# EAGLE design BSF (EAGLE 9.6.2)
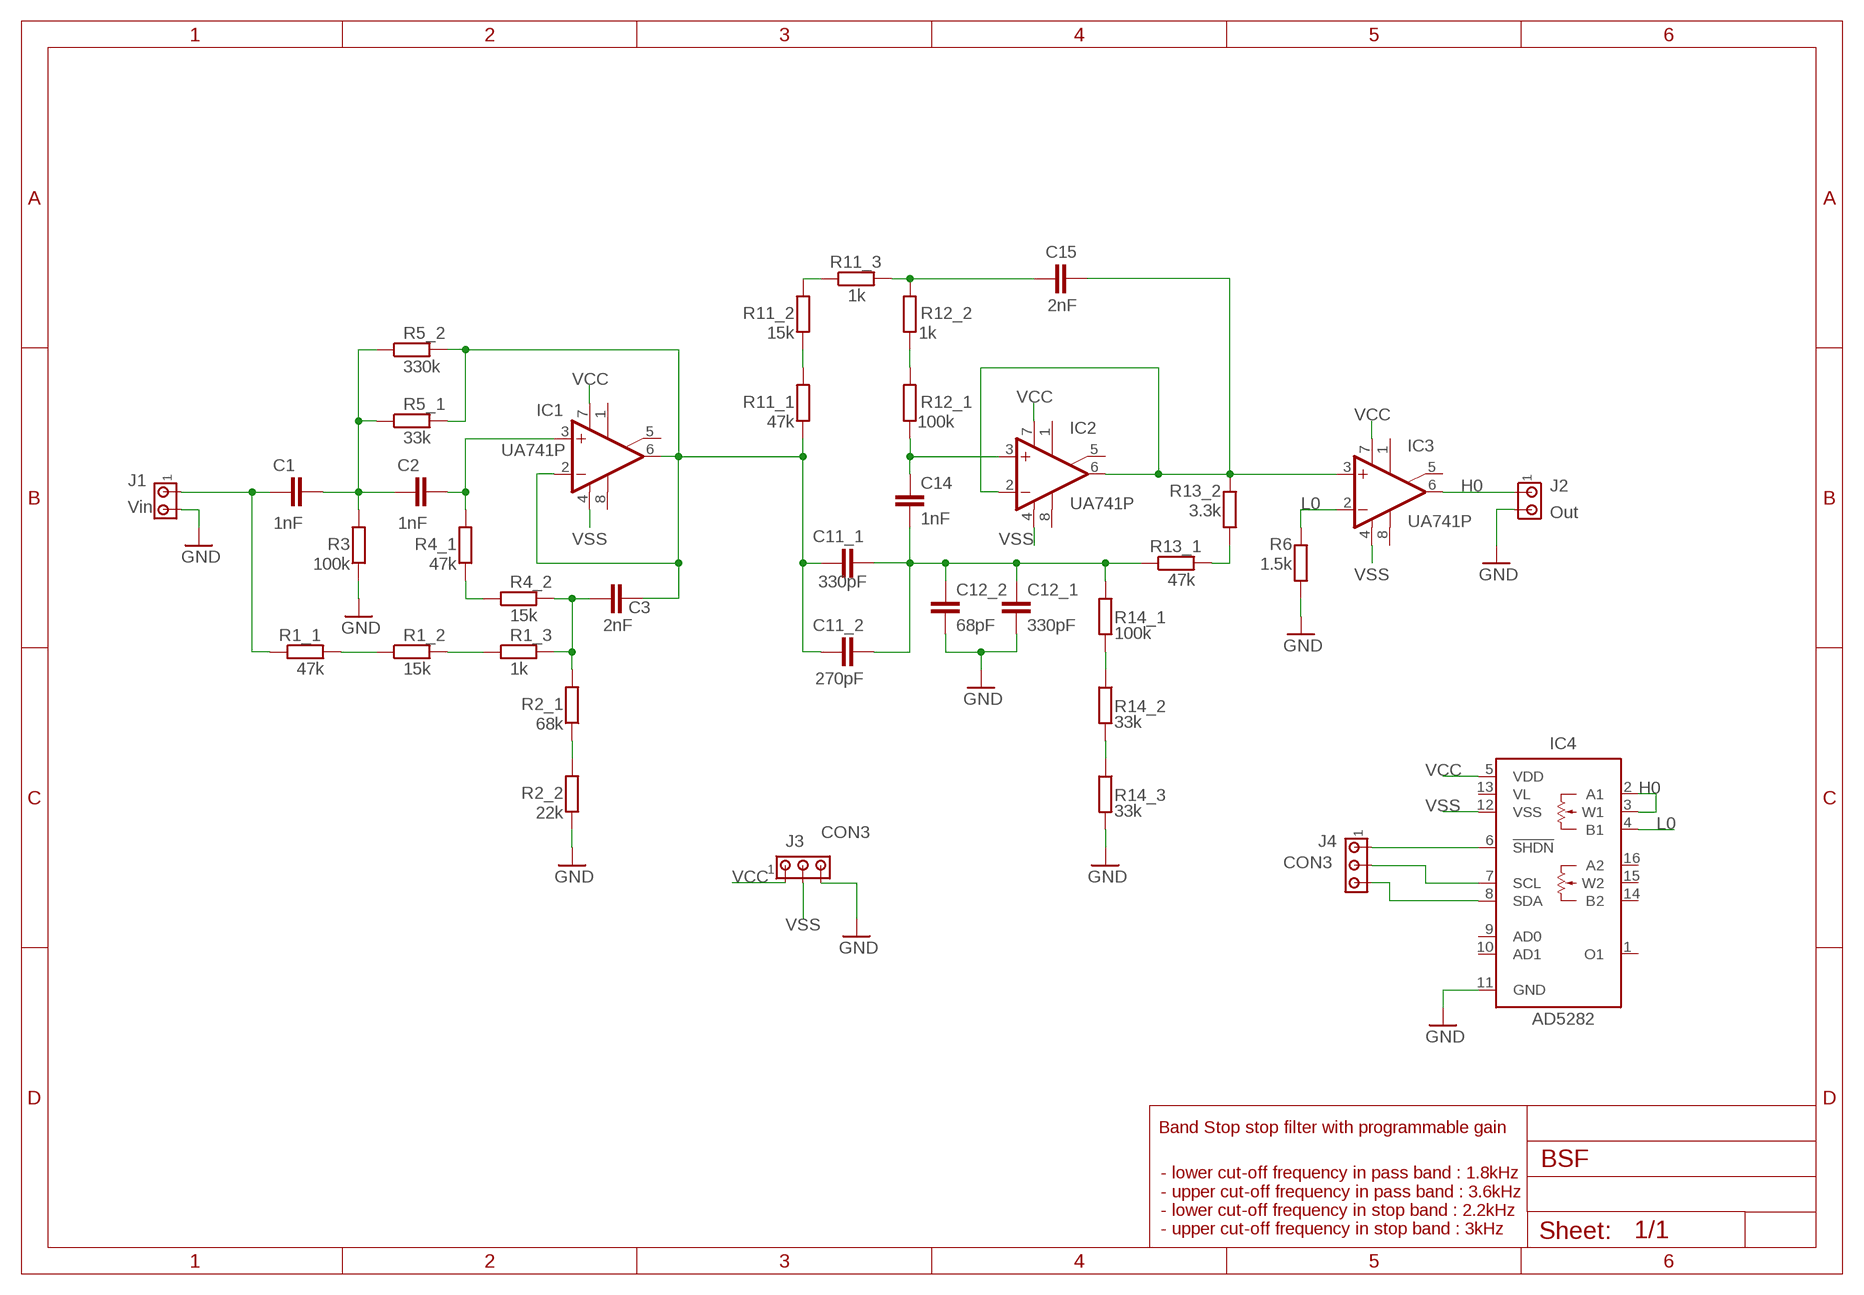
[diagram p0: schematic, sheet 1]

## Parts
C1  1nF  C-EUC0805  [C0805]
C2  1nF  C-EUC0805  [C0805]
C3  2nF  C-EUC0805  [C0805]
C11_1  330pF  C-EUC0805  [C0805]
C11_2  270pF  C-EUC0805  [C0805]
C12_1  330pF  C-EUC0805  [C0805]
C12_2  68pF  C-EUC0805  [C0805]
C14  1nF  C-EUC0805  [C0805]
C15  2nF  C-EUC0805  [C0805]
IC1  UA741P  [DIL08]
IC2  UA741P  [DIL08]
IC3  UA741P  [DIL08]
IC4  AD5282  [TSSOP16]
J1  Vin  MTA02-156  [1X2MTA]
J2  Out  MTA02-156  [1X2MTA]
J3  CON3  MTA03-156  [1X3MTA]
J4  CON3  MTA03-156  [1X3MTA]
R1_1  47k  R-EU_R0805  [R0805]
R1_2  15k  R-EU_R0805  [R0805]
R1_3  1k  R-EU_R0805  [R0805]
R2_1  68k  R-EU_R0805  [R0805]
R2_2  22k  R-EU_R0805  [R0805]
R3  100k  R-EU_R0805  [R0805]
R4_1  47k  R-EU_R0805  [R0805]
R4_2  15k  R-EU_R0805  [R0805]
R5_1  33k  R-EU_R0805  [R0805]
R5_2  330k  R-EU_R0805  [R0805]
R6  1.5k  R-EU_R0805  [R0805]
R11_1  47k  R-EU_R0805  [R0805]
R11_2  15k  R-EU_R0805  [R0805]
R11_3  1k  R-EU_R0805  [R0805]
R12_1  100k  R-EU_R0805  [R0805]
R12_2  1k  R-EU_R0805  [R0805]
R13_1  47k  R-EU_R0805  [R0805]
R13_2  3.3k  R-EU_R0805  [R0805]
R14_1  100k  R-EU_R0805  [R0805]
R14_2  33k  R-EU_R0805  [R0805]
R14_3  33k  R-EU_R0805  [R0805]

## Nets
GND: C12_1.2 C12_2.2 IC4.11(GND) J1.2 J2.2 J3.3 R2_2.1 R3.1 R6.1 R14_3.2
H0: IC3.6(OUT) IC4.2(A1) IC4.3(W1) J2.1
L0: IC3.2(-IN) IC4.4(B1) R6.2
N$1: C15.1 R11_3.2 R12_2.2
N$2: C1.1 J1.1 R1_1.1
N$3: C1.2 C2.1 R3.2 R5_1.1 R5_2.1
N$4: R1_1.2 R1_2.1
N$5: R1_2.2 R1_3.1
N$6: R4_1.1 R4_2.1
N$7: C2.2 IC1.3(+IN) R4_1.2
N$8: C3.1 R1_3.2 R2_1.2 R4_2.2
N$9: R2_1.1 R2_2.2
N$10: IC4.6(!SHDN) J4.1
N$11: IC4.7(SCL) J4.2
N$12: IC4.8(SDA) J4.3
N$13: R11_2.2 R11_3.1
N$14: C3.2 C11_1.1 C11_2.1 IC1.2(-IN) IC1.6(OUT) R5_1.2 R5_2.2 R11_1.1
N$15: R11_1.2 R11_2.1
N$16: R12_1.2 R12_2.1
N$17: C14.1 IC2.3(+IN) R12_1.1
N$18: C11_1.2 C11_2.2 C12_1.1 C12_2.1 C14.2 R13_1.1 R14_1.1
N$19: R14_1.2 R14_2.1
N$20: R14_2.2 R14_3.1
N$21: C15.2 IC2.2(-IN) IC2.6(OUT) IC3.3(+IN) R13_2.2
N$22: R13_1.2 R13_2.1
VCC: IC1.7(V+) IC2.7(V+) IC3.7(V+) IC4.5(VDD) J3.1
VSS: IC1.4(V-) IC2.4(V-) IC3.4(V-) IC4.12(VSS) J3.2
Unconnected: IC1.1(ON1) IC1.5(ON2) IC1.8(OPT) IC2.1(ON1) IC2.5(ON2) IC2.8(OPT) IC3.1(ON1) IC3.5(ON2) IC3.8(OPT) IC4.1(O1) IC4.9(AD0) IC4.10(AD1) IC4.14(B2) IC4.15(W2) IC4.16(A2)

## Notes on the sheet
- Band Stop stop filter with programmable gain
- - lower cut-off frequency in pass band : 1.8kHz
  - upper cut-off frequency in pass band : 3.6kHz
  - lower cut-off frequency in stop band : 2.2kHz
  - upper cut-off frequency in stop band : 3kHz

## Power pins joined to a net without a drawn wire
VL: IC4.13(VL)

## Library data of the parts
C1-C3 C11_1 C11_2 C12_1 C12_2 C14 C15 = rcl:C-EU: CAPACITOR, European symbol; SPICEPREFIX: C
IC1-IC3 = linear:*741: OP AMP
IC4 = analog-devices:AD5282: Dual +15 V/±5 V, 256-Position, I2C-Compatible Digital Potentiometer Source: http://www.analog.com/static/imported-files/data_sheets/AD5280_5282.pdf; MF: ALTERA CORPORATION; MPN: AD5282BRUZ50; OC_FARNELL: 1438442; OC_NEWARK: 59K3850
J1 J2 = con-amp:MTA02-156: AMP connector
J3 J4 = con-amp:MTA03-156: AMP connector
R1_1-R1_3 R2_1 R2_2 R3 R4_1 R4_2 R5_1 R5_2 R6 R11_1-R11_3 R12_1 R12_2 R13_1 R13_2 R14_1-R14_3 = rcl:R-EU_: RESISTOR, European symbol; SPICEPREFIX: R

## Net classes
0 default: width 0.381 mm, drill 0.508 mm, clearance 0.254 mm

## Board
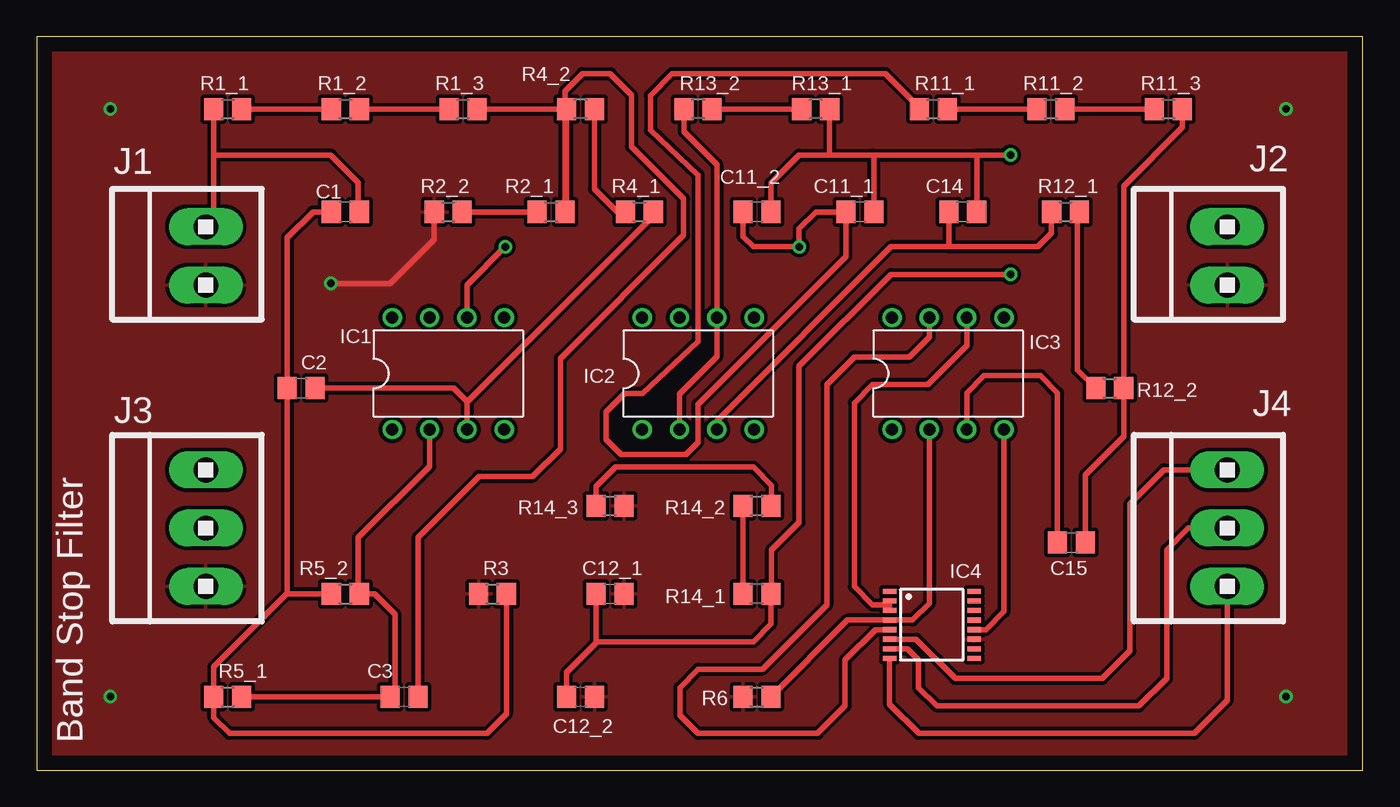
[diagram p1: board, top side]
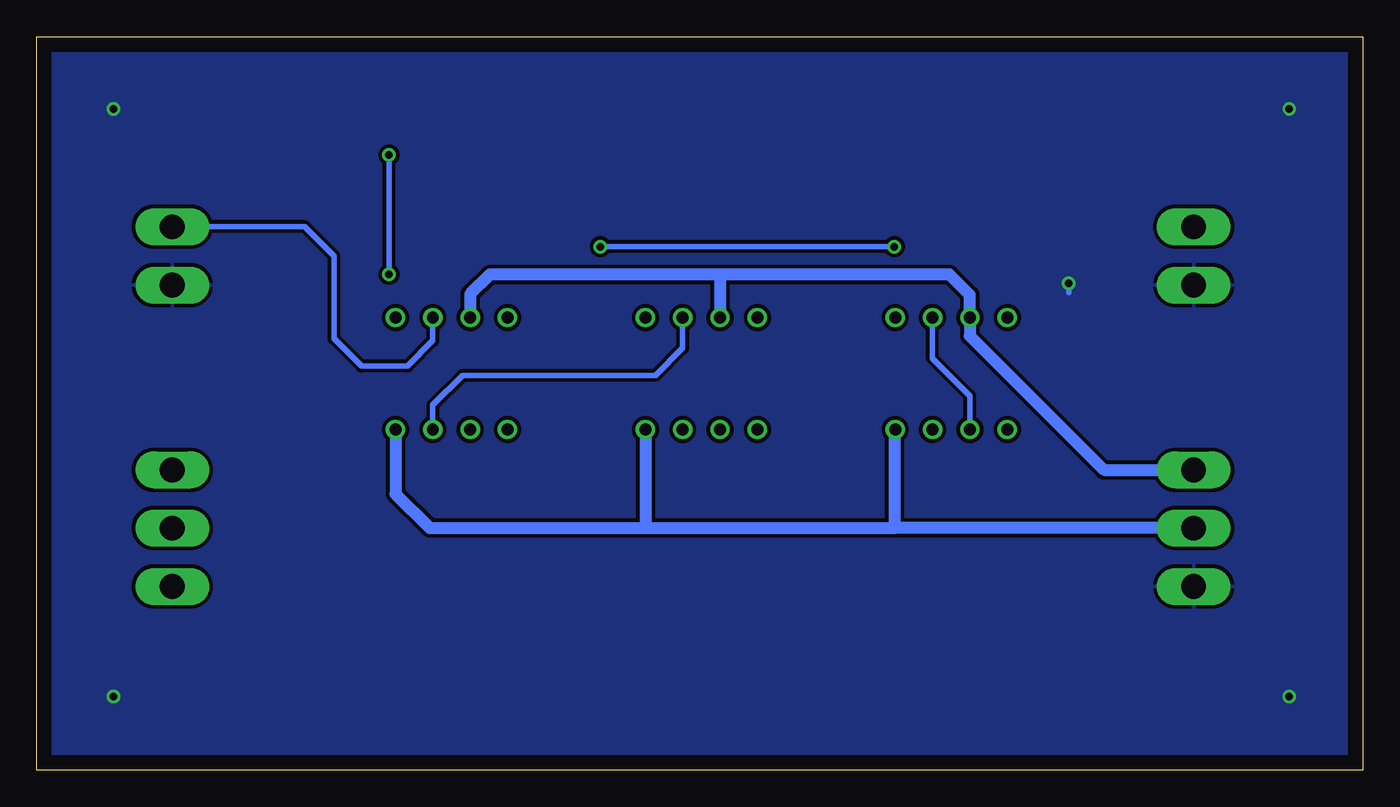
[diagram p2: board, bottom side, seen from below]

Size 90.22 x 49.92 mm. Coordinates in mm from the lower left corner, seen from the top.
Outline: 0,0 90.22,0 90.22,49.92 0,49.92 0,0
Copper layers (1*16): Top 0.035mm / dielectric 1.5mm / Bottom 0.035mm
Design rules "default": minimum track width 6mil, minimum drill 0.35mm, track to track 6mil, track to pad 6mil, pad to pad 6mil, via to via 6mil, smd to smd 6mil, copper to edge 40mil, drill to drill 6mil, minimum pad ring 10mil, minimum via ring 8mil, stop-mask expansion 4mil, vias tented up to drill 0mil, thermal gap 10mil

### Footprints (pad centres in the part's own frame; a part is rotated, then mirrored left to right if it is on the bottom)
C0805 = smd 1.3 x 1.5: 1 -0.95,0; 2 0.95,0
DIL08 = drill 0.813 pad 1.27: 1 -3.81,-3.81; 2 -1.27,-3.81; 3 1.27,-3.81; 4 3.81,-3.81; 5 3.81,3.81; 6 1.27,3.81; 7 -1.27,3.81; 8 -3.81,3.81
TSSOP16 = smd 0.9 x 0.35: 1 -2.875,2.275; 2 -2.875,1.625; 3 -2.875,0.975; 4 -2.875,0.325; 5 -2.875,-0.325; 6 -2.875,-0.975; 7 -2.875,-1.625; 8 -2.875,-2.275; 9 2.875,-2.275; 10 2.875,-1.625; 11 2.875,-0.975; 12 2.875,-0.325; 13 2.875,0.325; 14 2.875,0.975; 15 2.875,1.625; 16 2.875,2.275
1X2MTA = drill 1.676 long: 1 1.981,0; 2 -1.981,0
1X3MTA = drill 1.676 long: 1 3.937,0; 2 -0.025,0; 3 -3.988,0
R0805 = smd 1.3 x 1.5: 1 -0.95,0; 2 0.95,0

### Placement (x,y rotation side)
C1  21,38 180 top
C2  18,26 0 top
C3  25,5 180 top
C11_1  56,38 0 top
C11_2  49,38 0 top
C12_1  39,12 0 top
C12_2  37,5 0 top
C14  63,38 0 top
C15  70.41,15.5 180 top
IC1  28,27 0 top
IC2  45,27 0 top
IC3  62,27 0 top
IC4  60.9,9.89 0 top
J1  11.5,35 90 top
J2  81,35 90 top
J3  11.5,16.5 90 top
J4  81,16.5 90 top
R1_1  13,45 0 top
R1_2  21,45 0 top
R1_3  29,45 0 top
R2_1  35,38 0 top
R2_2  28,38 0 top
R3  31,12 0 top
R4_1  41,38 0 top
R4_2  37,45 180 top
R5_1  13,5 0 top
R5_2  21,12 0 top
R6  49,5 0 top
R11_1  61,45 0 top
R11_2  69,45 0 top
R11_3  77,45 0 top
R12_1  70,38 0 top
R12_2  73,26 0 top
R13_1  53,45 180 top
R13_2  45,45 180 top
R14_1  49,12 180 top
R14_2  49,18 0 top
R14_3  39,18 0 top

### Tracks (layer width: path | path; a pad name or v marks a point on that pad's centre or on a via)
GND  (via drill 0.51)
  Top 0.381: v20,33.12 24.05,33.12 27.05,36.12 R2_2.1
  Bottom 0.381: v20,33.12 20,32.5
  other vias: 5,5 85,45 85,5 5,45
  pour Top: -2.5,52.5 92.5,52.5 92.5,-2.5 -2.5,-2.5
  pour Bottom: -2.5,52.5 92.5,52.5 92.5,-2.5 -2.5,-2.5
H0
  Top 0.381: IC3.6 63.27,28.89 60.62,26.25 56.88,26.25 55.62,25 55.62,12.5 56.88,11.25 57.76,11.25 IC4.2 IC4.3
  Bottom 0.381: IC3.6 63.27,29.23 65,27.5 68.12,27.5 70,29.38 70,35 71.98,36.98 J2.1
L0
  Top 0.381: IC3.2 60.73,11.36 59.59,10.22 IC4.4 55.17,10.22 R6.2
N$1
  Top 0.381: C15.1 71.36,20.11 73.95,22.7 R12_2.2 73.95,39.75 77.95,43.75 R11_3.2
N$2
  Top 0.381: R1_1.1 12.05,41.88 | 12.05,41.88 12.05,36.98 J1.1 | C1.1 21.88,38.08 21.88,40 20,41.88 12.05,41.88
N$3
  Top 0.381: C1.2 18.8,38 17.05,36.25 C2.1 17.05,12 R5_2.1 17,12 12.05,7.05 R5_1.1 12.05,3.58 13.12,2.5 30.62,2.5 31.95,3.83 R3.2
N$4
  Top 0.381: R1_1.2 R1_2.1
N$5
  Top 0.381: R1_2.2 R1_3.1
N$6
  Top 0.381: R4_1.1 39.5,38 37.95,39.55 R4_2.1
N$7
  Top 0.381: C2.2 28.38,26 29.27,25.11 29.27,25.07 | R4_1.2 41.95,37.74 29.27,25.07 | 29.27,25.07 IC1.3
N$8
  Top 0.381: R1_3.2 R4_2.2 36.05,38.1 R2_1.2 35.95,46.23 37.13,47.41 39.01,47.41 40.46,45.96 40.46,42.45 44.01,38.9 44.01,36.42 35.62,28.04 35.62,21.88 33.75,20 30.09,20 25.95,15.86 C3.1
N$9
  Top 0.381: R2_1.1 R2_2.2
N$10
  Top 0.381: IC4.6 59.83,8.92 62.5,6.25 72.5,6.25 74.38,8.12 74.38,18.12 76.69,20.44 J4.1
N$11
  Top 0.381: IC4.7 59.23,8.27 60,7.5 60,5.62 61.25,4.38 75,4.38 76.88,6.25 76.88,15 78.35,16.48 J4.2
N$12
  Top 0.381: J4.3 81,4.75 78.75,2.5 60.02,2.5 58.02,4.5 IC4.8
N$13
  Top 0.381: R11_2.2 R11_3.1
N$14  (via drill 0.51)
  Top 0.381: R5_1.2 C3.2 24.38,5 24.38,10.62 23,12 R5_2.2 21.88,12.07 21.88,15.84 26.73,20.69 IC1.2 | C11_2.1 48.05,36.33 48.75,35.62 v51.88,35.62 51.88,36.88 53,38 C11_1.1 55.05,34.96 44.98,24.9 44.98,22.31 44.17,21.5 39.75,21.5 38.75,22.5 38.75,24.38 40,25.62 41.21,25.62 45,29.17 45,40.5 41.74,43.55 41.74,45.92 43.23,47.41 57.74,47.41 60.05,45.1 R11_1.1 | IC1.6 29.27,33.02 v31.88,35.62
  Bottom 0.381: IC1.2 26.73,25.48 29.27,28.02 IC1.6 | v31.88,35.62 v51.88,35.62
N$15
  Top 0.381: R11_1.2 R11_2.1
N$16
  Top 0.381: R12_1.2 70.8,37.85 70.8,27.25 R12_2.1
N$17
  Top 0.381: C14.1 62.05,35.62 | 62.05,35.62 68.12,35.62 69.05,36.55 R12_1.1 | 62.05,35.62 58.12,35.62 46.27,23.77 IC2.3
N$18  (via drill 0.51)
  Top 0.381: 63.95,41.88 C14.2 | C12_2.1 36.05,6.67 38.05,8.68 38.05,8.75 | C12_1.1 38.05,8.75 | 38.05,8.75 48.75,8.75 49.95,9.95 R14_1.1 50,12.05 50,15 51.88,16.88 51.88,27.5 58.12,33.75 v66.25,33.75 | v66.25,41.88 63.95,41.88 | C11_2.2 49.95,39.95 51.88,41.88 53.95,41.88 | R13_1.1 53.95,41.88 | 53.95,41.88 56.88,41.88 | 56.88,41.88 63.95,41.88 | C11_1.2 56.95,41.8 56.88,41.88
  Bottom 0.381: v66.25,33.75 v66.25,41.88
N$19
  Top 0.381: R14_1.2 R14_2.1
N$20
  Top 0.381: R14_3.1 38.05,19.3 39.38,20.62 48.75,20.62 50,19.38 50,18.05 R14_2.2
N$21
  Top 0.381: R13_2.2 44.05,43.45 46.27,41.23 IC2.6 46.27,28.14 43.73,25.61 IC2.2 | IC3.3 63.27,25.69 64.45,26.88 68.27,26.88 69.45,25.69 C15.2
  Bottom 0.381: IC2.6 46.27,28.73 48.12,26.88 61.25,26.88 63.27,24.86 IC3.3
N$22
  Top 0.381: R13_1.2 R13_2.1
VCC
  Top 0.381: IC4.5 57.07,9.57 55,7.5 55,4.38 53.12,2.5 45,2.5 43.75,3.75 43.75,5.62 45,6.88 49.38,6.88 53.75,11.25 53.75,26.25 55.62,28.12 59.38,28.12 60.73,29.48 IC3.7
  Bottom 0.813: J3.1 17.61,20.44 26.73,29.56 IC1.7 26.73,32.35 28.12,33.75 43.73,33.75 | 43.73,33.75 IC2.7 | 43.73,33.75 59.38,33.75 60.73,32.4 IC3.7
VSS
  Top 0.381: IC3.4 65.81,10.81 64.57,9.57 IC4.12
  Bottom 0.381: IC1.4 31.88,23.12
  Bottom 0.813: J3.2 31.88,16.48 | 31.88,23.12 31.88,16.48 | IC2.4 48.81,16.48 | 48.81,16.48 31.88,16.48 | IC3.4 65.81,18.82 63.47,16.48 48.81,16.48

### Text on the board
tPlace: Band Stop Filter